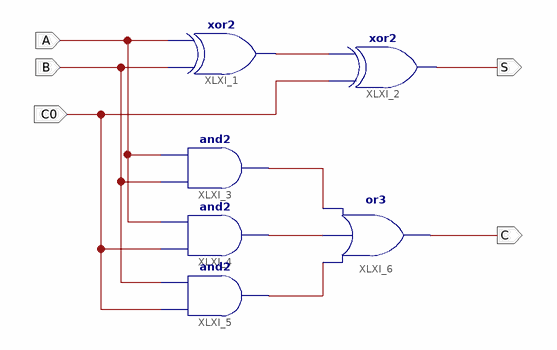
[diagram p0: schematic sheet 1]
// Xilinx ISE schematic Fadder.sch (spartan6) as structural Verilog: 6 symbols, 5 ports
module Fadder (
  input  A,
  input  B,
  input  C0,
  output C,
  output S
);

  wire XLXN_3, XLXN_11, XLXN_12, XLXN_13;

  xor XLXI_1 (XLXN_3, B, A);
  xor XLXI_2 (S, C0, XLXN_3);
  and XLXI_3 (XLXN_11, B, A);
  and XLXI_4 (XLXN_12, C0, A);
  and XLXI_5 (XLXN_13, C0, B);
  or XLXI_6 (C, XLXN_13, XLXN_12, XLXN_11);
endmodule
